# Altium project rp2040_isp_stamp.PrjPcb
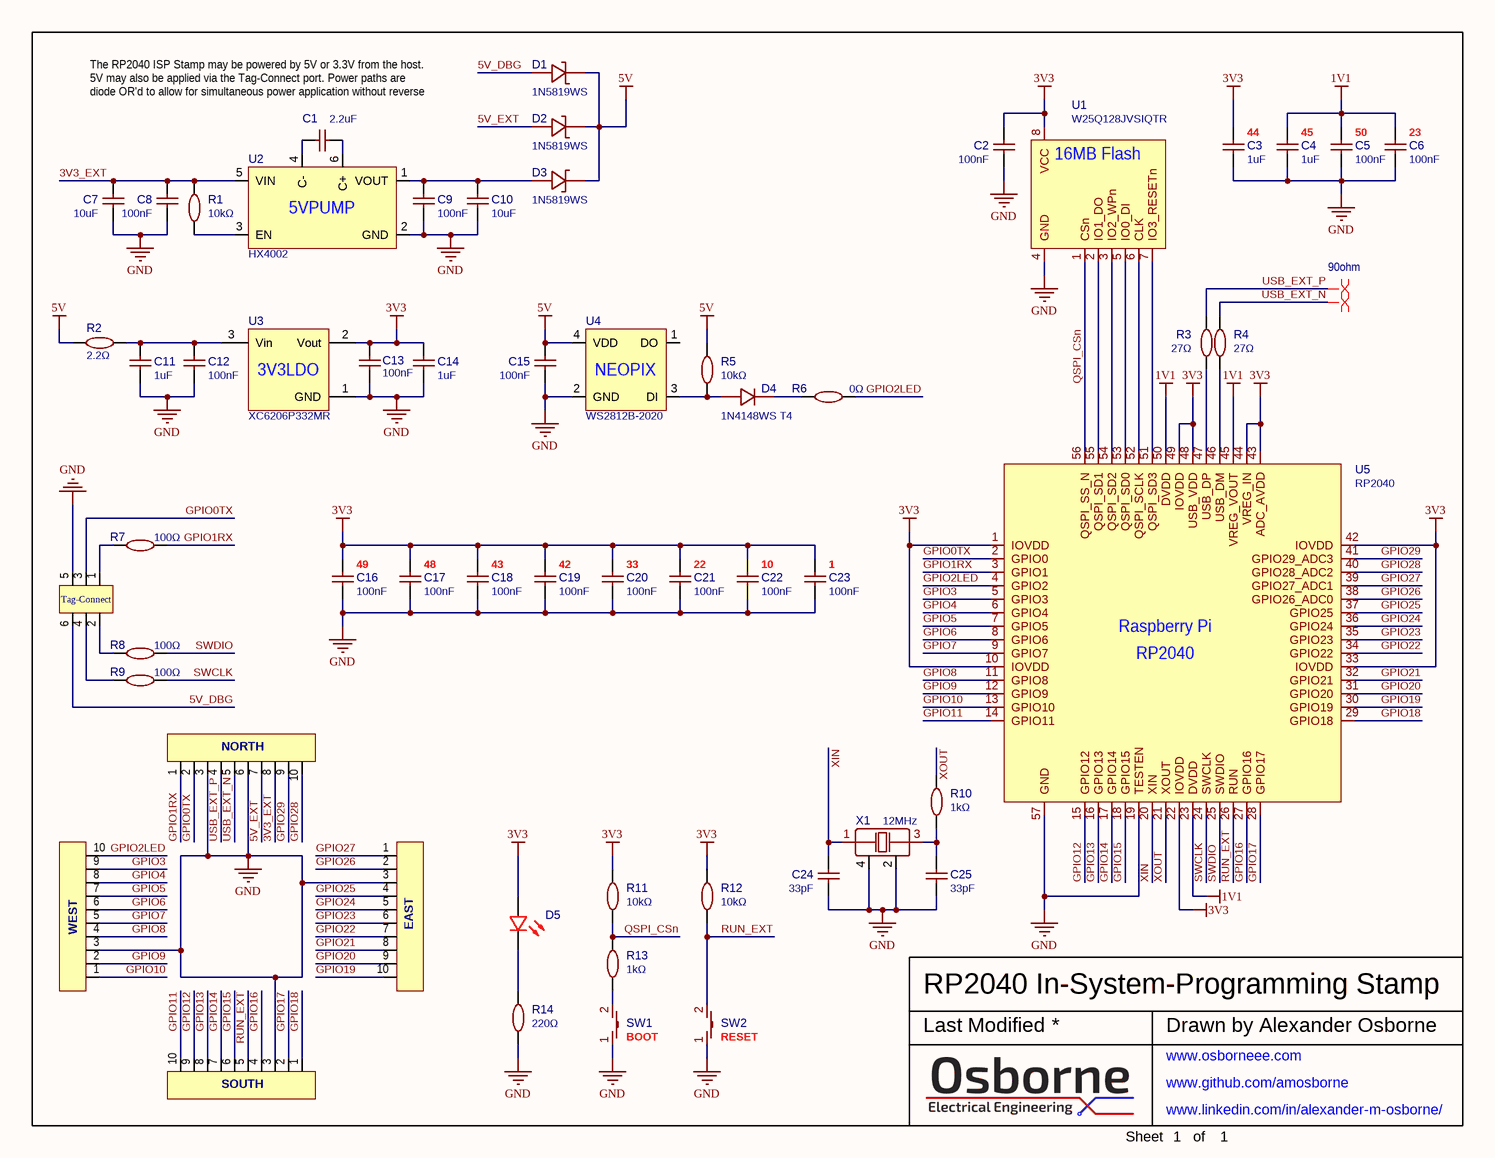
[diagram p0: schematic.SchDoc]
1 sheet, 57 parts. Net scope: global (net labels, ports and power ports of the same name join across sheets).
Board files: pcb_v2.PcbDoc, rp2040_isp_stamp_panel.PcbDoc

## Sheet schematic.SchDoc: RP2040 In-System-Programming Stamp
size Letter; Organization: ORGANIZATION; Address1: ADDRESS 1; Address2: ADDRESS 2; Address3: ADDRESS 3; Address4: ADDRESS 4; Revision: -; SheetNumber: 1; SheetTotal: 1; ENG_APP_DATE: --/--/--; DSN_APP_DATE: --/--/--; CHK_APP_DATE: --/--/--

### Parts
C1  2.2uF  [C0603]
C2  100nF  [C0402]
C3  1uF  [C0402]
C4  1uF  [C0402]
C5  100nF  [C0402]
C6  100nF  [C0402]
C7  10uF  [C0603]
C8  100nF  [C0402]
C9  100nF  [C0402]
C10  10uF  [C0603]
C11  1uF  [C0402]
C12  100nF  [C0402]
C13  100nF  [C0402]
C14  1uF  [C0402]
C15  100nF  [C0402]
C16  100nF  [C0402]
C17  100nF  [C0402]
C18  100nF  [C0402]
C19  100nF  [C0402]
C20  100nF  [C0402]
C21  100nF  [C0402]
C22  100nF  [C0402]
C23  100nF  [C0402]
C24  33pF  [C0402]
C25  33pF  [C0402]
D1  1N5819WS  [SOD-323_L1.8-W1.3-LS2.5-RD]
D2  1N5819WS  [SOD-323_L1.8-W1.3-LS2.5-RD]
D3  1N5819WS  [SOD-323_L1.8-W1.3-LS2.5-RD]
D4  1N4148WS T4  [SOD-323_L1.8-W1.3-LS2.5-RD]
D5  19-217/GHC-YR1S2/3T  [LED0603-R-RD]  (value not drawn)
EAST  STAMPEDGE  [CASTELLATIONS]  (value not drawn)  (no BOM)
J1  TC2030-IDC-NL  [TC2030-IDC-NL]  (value not drawn)  (no BOM)
NORTH  STAMPEDGE  [CASTELLATIONS]  (value not drawn)  (no BOM)
R1  10kΩ  [R0402]
R2  2.2Ω  [R0603]
R3  27Ω  [R0603]
R4  27Ω  [R0603]
R5  10kΩ  [R0402]
R6  0Ω  [R0805]
R7  100Ω  [R0402]
R8  100Ω  [R0402]
R9  100Ω  [R0402]
R10  1kΩ  [R0402]
R11  10kΩ  [R0402]
R12  10kΩ  [R0402]
R13  1kΩ  [R0402]
R14  220Ω  [R0402]
SOUTH  STAMPEDGE  [CASTELLATIONS]  (value not drawn)  (no BOM)
SW1  B3U-1000P  [KEY-SMD_B3U-1000PM]  (value not drawn)
SW2  B3U-1000P  [KEY-SMD_B3U-1000PM]  (value not drawn)
U1  W25Q128JVSIQTR  [SOIC-8_L5.3-W5.3-P1.27-LS8.0-BL]
U2  HX4002  [SOT-23-6_L2.9-W1.6-P0.95-LS2.8-BR]
U3  XC6206P332MR  [SOT-23-3_L2.9-W1.6-P1.90-LS2.8-BR]
U4  WS2812B-2020  [LED-SMD_4P-L2.0-W2.0-TL_WS2812B-2020]
U5  RP2040  [LQFN-56_L7.0-W7.0-P0.4-EP]
WEST  STAMPEDGE  [CASTELLATIONS]  (value not drawn)  (no BOM)
X1  12MHz  [OSC-SMD_4P-L3.2-W2.5-BL]

### Nets
1V1: C4.2 C5.2 C6.2 U5.23(DVDD) U5.45(VREG_VOUT) U5.50(DVDD)
3V3: C2.2 C3.2 C13.2 C14.2 C16.2 C17.2 C18.2 C19.2 C20.2 C21.2 C22.2 C23.2 D5.1(A) R11.2 R12.2 U1.8(VCC) U3.2(Vout) U5.1(IOVDD) U5.10(IOVDD) U5.22(IOVDD) U5.33(IOVDD) U5.42(IOVDD) U5.43(ADC_AVDD) U5.44(VREG_IN) U5.48(USB_VDD) U5.49(IOVDD)
5V: C15.2 D1.1(C) D2.1(C) D3.1(C) R2.1 R5.2 U4.4(VDD)
GND: C2.1 C3.1 C4.1 C5.1 C6.1 C7.1 C8.1 C9.1 C10.1 C11.1 C12.1 C13.1 C14.1 C15.1 C16.1 C17.1 C18.1 C19.1 C20.1 C21.1 C22.1 C23.1 C24.1 C25.1 EAST.3 J1.5 NORTH.3 NORTH.6 R14.1 SOUTH.3 SW1.1 SW2.1 U1.4(GND) U2.2(GND) U3.1(GND) U4.2(GND) U5.19(TESTEN) U5.57(GND) WEST.3 X1.2(GND) X1.4(GND)
3V3_EXT: C7.2 C8.2 NORTH.8 R1.2 U2.5(VIN)
5V_DBG: D1.2(A) J1.6
5V_EXT: D2.2(A) NORTH.7
GPIO0TX: J1.3 NORTH.2 U5.2(GPIO0)
GPIO1RX: NORTH.1 R7.1 U5.3(GPIO1)
GPIO2LED: R6.2 U5.4(GPIO2) WEST.10
GPIO3: U5.5(GPIO3) WEST.9
GPIO4: U5.6(GPIO4) WEST.8
GPIO5: U5.7(GPIO5) WEST.7
GPIO6: U5.8(GPIO6) WEST.6
GPIO7: U5.9(GPIO7) WEST.5
GPIO8: U5.11(GPIO8) WEST.4
GPIO9: U5.12(GPIO9) WEST.2
GPIO10: U5.13(GPIO10) WEST.1
GPIO11: SOUTH.10 U5.14(GPIO11)
GPIO12: SOUTH.9 U5.15(GPIO12)
GPIO13: SOUTH.8 U5.16(GPIO13)
GPIO14: SOUTH.7 U5.17(GPIO14)
GPIO15: SOUTH.6 U5.18(GPIO15)
GPIO16: SOUTH.4 U5.27(GPIO16)
GPIO17: SOUTH.2 U5.28(GPIO17)
GPIO18: SOUTH.1 U5.29(GPIO18)
GPIO19: EAST.10 U5.30(GPIO19)
GPIO20: EAST.9 U5.31(GPIO20)
GPIO21: EAST.8 U5.32(GPIO21)
GPIO22: EAST.7 U5.34(GPIO22)
GPIO23: EAST.6 U5.35(GPIO23)
GPIO24: EAST.5 U5.36(GPIO24)
GPIO25: EAST.4 U5.37(GPIO25)
GPIO26: EAST.2 U5.38(GPIO26_ADC0)
GPIO27: EAST.1 U5.39(GPIO27_ADC1)
GPIO28: NORTH.10 U5.40(GPIO28_ADC2)
GPIO29: NORTH.9 U5.41(GPIO29_ADC3)
QSPI_CSn: R11.1 R13.2 U1.1(CSn) U5.56(QSPI_SS_N)
RUN_EXT: R12.1 SOUTH.5 SW2.2 U5.26(RUN)
SWCLK: R9.1 U5.24(SWCLK)
SWDIO: R8.1 U5.25(SWDIO)
USB_EXT_N: NORTH.5 R4.2
USB_EXT_P: NORTH.4 R3.2
XIN: C24.2 U5.20(XIN) X1.1(OSC1)
XOUT: R10.1 U5.21(XOUT)
NetC1_1: C1.1 U2.6(C+)
NetC1_2: C1.2 U2.4(C-)
NetC9_2: C9.2 C10.2 D3.2(A) U2.1(VOUT)
NetC11_2: C11.2 C12.2 R2.2 U3.3(Vin)
NetC25_2: C25.2 R10.2 X1.3(OSC2)
NetD4_1: D4.1(K) R6.1
NetD4_2: D4.2(A) R5.1 U4.3(DI)
NetD5_2: D5.2(C) R14.2
NetJ1_1: J1.1 R7.2
NetJ1_2: J1.2 R8.2
NetJ1_4: J1.4 R9.2
NetR1_1: R1.1 U2.3(EN)
NetR3_1: R3.1 U5.47(USB_DP)
NetR4_1: R4.1 U5.46(USB_DM)
NetR13_1: R13.1 SW1.2
NetU1_2: U1.2(IO1_DO) U5.55(QSPI_SD1)
NetU1_3: U1.3(IO2_WPn) U5.54(QSPI_SD2)
NetU1_5: U1.5(IO0_DI) U5.53(QSPI_SD0)
NetU1_6: U1.6(CLK) U5.52(QSPI_SCLK)
NetU1_7: U1.7(IO3_RESETn) U5.51(QSPI_SD3)

Not connected (* = marked no-connect by the designer): U4 1(DO)

### Layout directives
differential pair; differential pair class 90ohm: USB_EXT_N, USB_EXT_P

### Notes on the sheet
- (near C1) The RP2040 ISP Stamp may be powered by 5V or 3.3V from the host. 5V may also be applied via the Tag-Connect port. Power paths are diode OR'd to allow for simultaneous power application without reverse current.
- (near C3) 44
- (near C4) 45
- (near C5) 50
- (near C6) 23
- (near C16) 49
- (near C17) 48
- (near C18) 43
- (near C19) 42
- (near C20) 33
- (near C21) 22
- (near C22) 10
- (near C23) 1
- (near SW1) BOOT
- (near SW2) RESET
- Last Modified
- Drawn by Alexander Osborne
- www.osborneee.com <http://www.osborneee.com>
- www.github.com/amosborne <http://www.github.com/amosborne>
- Sheet
- www.linkedin.com/in/alexander-m-osborne/ <http://www.linkedin.com/in/alexander-m-osborne/>
- of
- (in symbol HX4002) 5VPUMP
- (in symbol RP2040) Raspberry Pi
- (in symbol TC2030-IDC-NL) Tag-Connect
- (in symbol W25Q128JVSIQTR) 16MB Flash
- (in symbol WS2812B-2020) NEOPIX
- (in symbol XC6206P332MR) 3V3LDO

### Library data of the parts
C1 = 2.2uF: 16V 2.2uF X5R ±10% 0603  Multilayer Ceramic Capacitors MLCC - SMD/SMT ROHS; BOM_Manufacturer Part: CL10A225KO8NNNC; BOM_Manufacturer: SAMSUNG; nameAlias: Capacitance; BOM_Supplier: LCSC; BOM_Supplier Part: C23630; BOM_JLCPCB Part Class: Basic Part; spicePre: C; spiceSymbolName: CL10A225KO8NNNC
C2 C5 C6 C8 C9 C12 C13 C15-C23 = 100nF: 16V 100nF X7R ±10% 0402  Multilayer Ceramic Capacitors MLCC - SMD/SMT ROHS; BOM_Manufacturer Part: CL05B104KO5NNNC; BOM_Manufacturer: SAMSUNG; nameAlias: Capacitance; BOM_Supplier: LCSC; BOM_Supplier Part: C1525; BOM_JLCPCB Part Class: Basic Part; spicePre: C; spiceSymbolName: CL05B104KO5NNNC
C3 C4 C11 C14 = 1uF: 25V 1uF X5R ±10% 0402  Multilayer Ceramic Capacitors MLCC - SMD/SMT ROHS; BOM_Manufacturer: SAMSUNG; BOM_Manufacturer Part: CL05A105KA5NQNC; nameAlias: Capacitance; BOM_Supplier: LCSC; BOM_Supplier Part: C52923; BOM_JLCPCB Part Class: Basic Part; spicePre: C; spiceSymbolName: CL05A105KA5NQNC
C7 C10 = 10uF: X5R 25V ±20% 10uF 0603 Multilayer Ceramic Capacitors MLCC - SMD/SMT ROHS; BOM_Manufacturer: SAMSUNG; BOM_Manufacturer Part: CL10A106MA8NRNC; nameAlias: Capacitance; BOM_Supplier: LCSC; BOM_Supplier Part: C96446; BOM_JLCPCB Part Class: Basic Part; spicePre: C; spiceSymbolName: CL10A106MA8NRNC
C24 C25 = 33pF: 50V 33pF C0G ±5% 0402  Multilayer Ceramic Capacitors MLCC - SMD/SMT ROHS; BOM_Manufacturer: FH; BOM_Manufacturer Part: 0402CG330J500NT; nameAlias: Capacitance; BOM_Supplier: LCSC; BOM_Supplier Part: C1562; BOM_JLCPCB Part Class: Basic Part; spicePre: C; spiceSymbolName: 0402CG330J500NT
D1-D3 = 1N5819WS: 40V 600mV@1A 1A SOD-323  Schottky Barrier Diodes (SBD) ROHS; BOM_Manufacturer: Guangdong Hottech; Contributor: LCSC; BOM_Supplier: LCSC; BOM_Supplier Part: C191023; BOM_Manufacturer Part: 1N5819WS; BOM_JLCPCB Part Class: Basic Part; spicePre: D; spiceSymbolName: 1N5819WS
D4 = 1N4148WS T4: 100V +150℃@(Tj) 200mW Single 1.25V@150mA 4ns 1μA@75V 150mA SOD-323  Switching Diode ROHS; BOM_Manufacturer: CJ; BOM_Supplier: LCSC; BOM_Manufacturer Part: 1N4148WS T4; BOM_Supplier Part: C2128; BOM_JLCPCB Part Class: Basic Part; spicePre: D; spiceSymbolName: 1N4148WS T4
D5 = 19-217/GHC-YR1S2/3T: 20mA 285mcd 3.3V 518nm Colorless transparence -40℃~+85℃ 520nm~535nm Emerald 120° 110mW 0603  Light Emitting Diodes (LED) ROHS; BOM_Manufacturer: EVERLIGHT; BOM_Supplier: LCSC; BOM_Manufacturer Part: 19-217/GHC-YR1S2/3T; BOM_Supplier Part: C72043; BOM_JLCPCB Part Class: Basic Part; spicePre: L; spiceSymbolName: 19-217/GHC-YR1S2/3T
EAST NORTH SOUTH WEST = STAMPEDGE: RP2040 ISP Stamp Castellations
J1 = TC2030-IDC-NL: Tag-Connect 6-Pin No Legs
R1 R5 R11 R12 = 10kΩ: 1/16W Thick Film Resistors 50V ±1% ±100ppm/℃ -55℃~+155℃ 10kΩ 0402  Chip Resistor - Surface Mount ROHS; BOM_Manufacturer: UniOhm; BOM_Manufacturer Part: 0402WGF1002TCE; nameAlias: Resistance; Resistance (Ohms): 10K; BOM_Supplier: LCSC; BOM_Supplier Part: C25744; BOM_JLCPCB Part Class: Basic Part; spicePre: R; spiceSymbolName: 0402WGF1002TCE
R2 = 2.2Ω: 1/10W Thick Film Resistors 75V ±1% ±400ppm/℃ -55℃~+155℃ 2.2Ω 0603  Chip Resistor - Surface Mount ROHS; BOM_Manufacturer: UniOhm; BOM_Manufacturer Part: 0603WAF220KT5E; nameAlias: Resistance; Resistance (Ohms): 2.2; BOM_Supplier: LCSC; BOM_Supplier Part: C22939; BOM_JLCPCB Part Class: Basic Part; spicePre: R; spiceSymbolName: 0603WAF220KT5E
R3 R4 = 27Ω: 1/10W Thick Film Resistors 75V ±1% ±200ppm/℃ -55℃~+155℃ 27Ω 0603  Chip Resistor - Surface Mount ROHS; BOM_Manufacturer: UniOhm; BOM_Manufacturer Part: 0603WAF270JT5E; nameAlias: Resistance; Resistance (Ohms): 27; BOM_Supplier: LCSC; BOM_Supplier Part: C25190; BOM_JLCPCB Part Class: Basic Part; spicePre: R; spiceSymbolName: 0603WAF270JT5E
R6 = 0Ω: 125mW Thick Film Resistors 150V ±1% ±800ppm/℃ -55℃~+155℃ 0mΩ 0805  Chip Resistor - Surface Mount ROHS; BOM_Manufacturer: UniOhm; BOM_Manufacturer Part: 0805W8F0000T5E; nameAlias: Resistance; Resistance (Ohms): 0; BOM_Supplier: LCSC; BOM_Supplier Part: C17477; BOM_JLCPCB Part Class: Basic Part; spicePre: R; spiceSymbolName: 0805W8F0000T5E
R7-R9 = 100Ω: 1/16W Thick Film Resistors 50V ±1% ±200ppm/℃ -55℃~+155℃ 100Ω 0402  Chip Resistor - Surface Mount ROHS; BOM_Manufacturer: UniOhm; BOM_Manufacturer Part: 0402WGF1000TCE; nameAlias: Resistance; Resistance (Ohms): 100; BOM_Supplier: LCSC; BOM_Supplier Part: C25076; BOM_JLCPCB Part Class: Basic Part; spicePre: R; spiceSymbolName: 0402WGF1000TCE
R10 R13 = 1kΩ: 1/16W Thick Film Resistors 50V ±1% ±100ppm/℃ -55℃~+155℃ 1kΩ 0402  Chip Resistor - Surface Mount ROHS; BOM_Manufacturer: UniOhm; BOM_Manufacturer Part: 0402WGF1001TCE; nameAlias: Resistance; Resistance (Ohms): 1K; BOM_Supplier: LCSC; BOM_Supplier Part: C11702; BOM_JLCPCB Part Class: Basic Part; spicePre: R; spiceSymbolName: 0402WGF1001TCE
R14 = 220Ω: 1/16W Thick Film Resistors 50V ±1% ±100ppm/℃ -55℃~+155℃ 220Ω 0402  Chip Resistor - Surface Mount ROHS; BOM_Manufacturer: UniOhm; BOM_Manufacturer Part: 0402WGF2200TCE; nameAlias: Resistance; Resistance (Ohms): 220; BOM_Supplier: LCSC; BOM_Supplier Part: C25091; BOM_JLCPCB Part Class: Basic Part; spicePre: R; spiceSymbolName: 0402WGF2200TCE
SW1 SW2 = B3U-1000P: 2.5mm 1.6mm Round Button 50mA Brick nogging 3mm SPST 12V SMD,3x2.5x1.6mm  Tactile Switches ROHS; BOM_Manufacturer: Omron Electronics; Contributor: LCSC; BOM_Supplier: LCSC; BOM_Supplier Part: C231329; BOM_Manufacturer Part: B3U-1000P; BOM_JLCPCB Part Class: Extended Part; spicePre: S; spiceSymbolName: B3U-1000P
U1 = W25Q128JVSIQTR: SOIC-8_208mil  NOR FLASH ROHS; BOM_Manufacturer: WINBOND; BOM_Supplier: LCSC; BOM_Manufacturer Part: W25Q128JVSIQTR; BOM_Supplier Part: C97521; BOM_JLCPCB Part Class: Basic Part; spicePre: U; spiceSymbolName: W25Q128JVSIQTR
U2 = HX4002: NO Charge pump 1 5V 2.7V~5.5V 250mA 1.2MHz SOT-23-6  DC-DC Converters ROHS; BOM_Manufacturer: HEXIN; Contributor: LCSC; BOM_Supplier: LCSC; BOM_Manufacturer Part: HX4002; BOM_Supplier Part: C172354; BOM_JLCPCB Part Class: Extended Part; spicePre: U; spiceSymbolName: HX4002
U3 = XC6206P332MR: 200mA 680mV@(100mA) Fixed 3.3V~3.3V Positive 1 6V SOT-23-3L  Linear Voltage Regulators (LDO) ROHS; BOM_Manufacturer: TOREX; BOM_Supplier: LCSC; BOM_Manufacturer Part: XC6206P332MR; BOM_Supplier Part: C5446; BOM_JLCPCB Part Class: Basic Part; spicePre: U; spiceSymbolName: XC6206P332MR
U4 = WS2812B-2020: 5mA 5.3V -25℃~+85℃ RGB SMD,2x2mm  Light Emitting Diodes (LED) ROHS; BOM_Manufacturer: Worldsemi; Contributor: LCSC; BOM_Supplier: LCSC; BOM_Supplier Part: C965555; BOM_Manufacturer Part: WS2812B-2020; BOM_JLCPCB Part Class: Extended Part; spicePre: L; spiceSymbolName: WS2812B-2020
U5 = RP2040: ARM Cortex-M0 1@x4ch/12bit USB Host/Device 2 264KB 2 133MHz 30 2 QFN-56(7x7)  Microcontroller Units (MCUs/MPUs/SOCs) ROHS; BOM_Manufacturer: Raspberry Pi(树莓派); Contributor: LCSC; BOM_Supplier: LCSC; BOM_Supplier Part: C2040; BOM_Manufacturer Part: RP2040; BOM_JLCPCB Part Class: Extended Part; spicePre: U; spiceSymbolName: RP2040
X1 = 12MHz: 12MHz SMD Crystal Resonator 20pF ±10ppm ±30ppm -40℃~+85℃ SMD3225-4P  Crystals ROHS; BOM_Manufacturer: YXC; BOM_Manufacturer Part: X322512MSB4SI; nameAlias: Frequency; BOM_Supplier: LCSC; BOM_Supplier Part: C9002; BOM_JLCPCB Part Class: Basic Part; spicePre: X; spiceSymbolName: X322512MSB4SI